# EAGLE design Rev 1 (EAGLE 5.11)
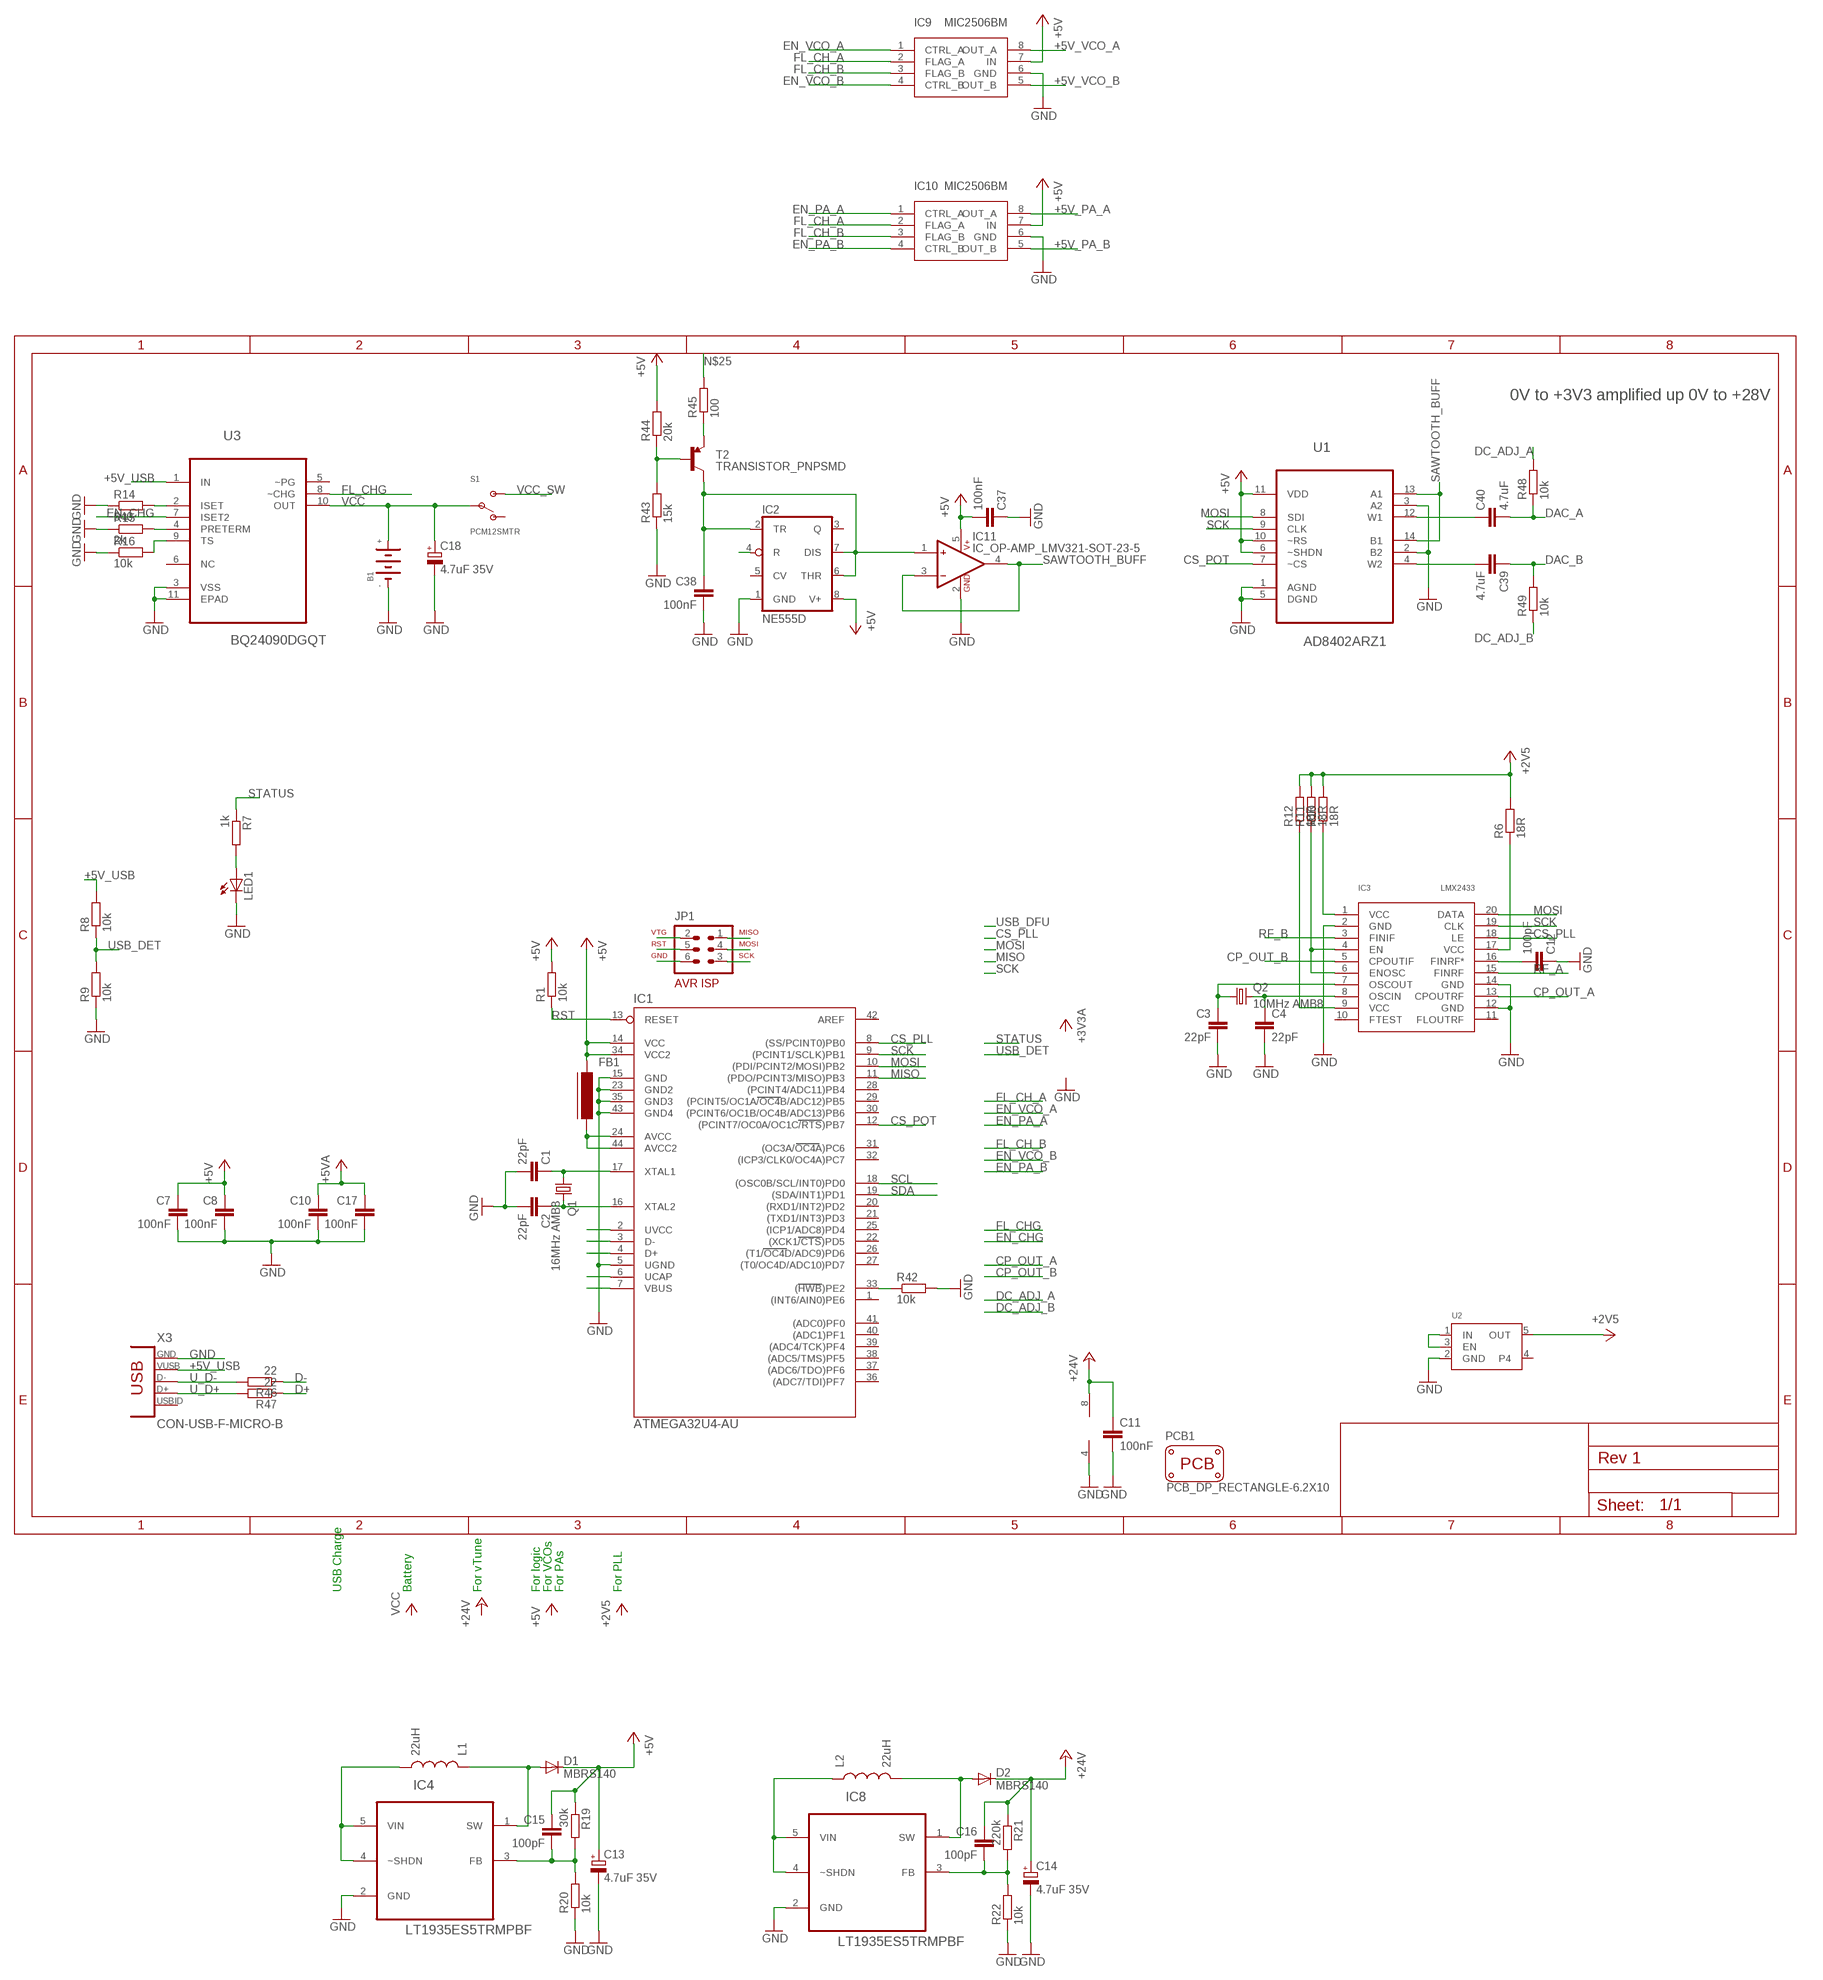
[diagram p0: schematic, sheet 1, part 1 of 2]
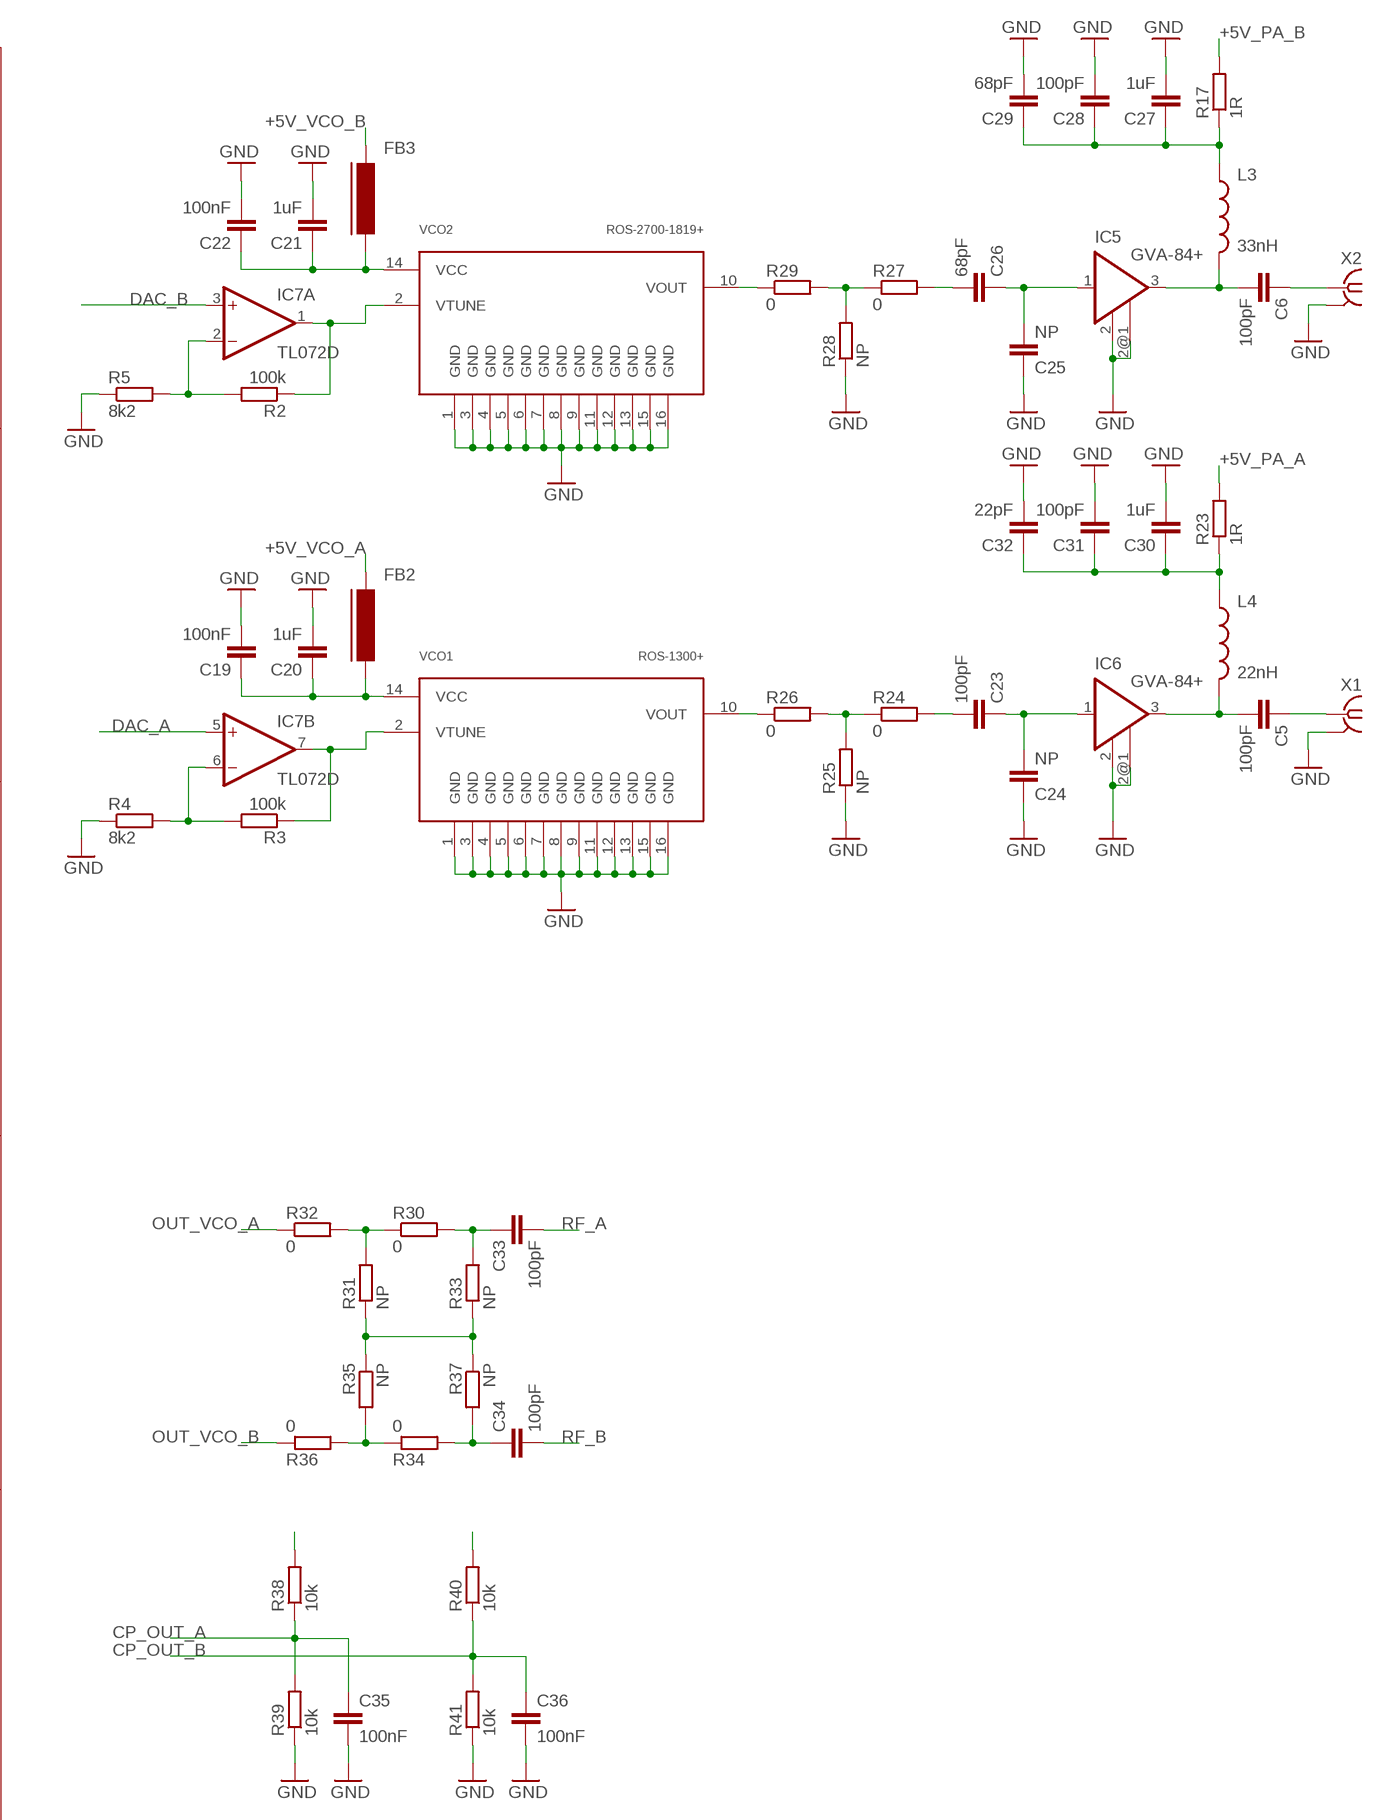
[diagram p1: schematic, sheet 1, part 2 of 2]

## Parts
B1  BATTERY  [JSTPH2]
C1  22pF  C-EUC0603K  [C0603K]
C2  22pF  C-EUC0603K  [C0603K]
C3  22pF  C-EUC0603K  [C0603K]
C4  22pF  C-EUC0603K  [C0603K]
C5  100pF  C-EUC0603K  [C0603K]
C6  100pF  C-EUC0603K  [C0603K]
C7  100nF  C-EUC0603K  [C0603K]
C8  100nF  C-EUC0603K  [C0603K]
C10  100nF  C-EUC0603K  [C0603K]
C11  100nF  C-EUC0603K  [C0603K]
C12  100pF  C-EUC0603K  [C0603K]
C13  4.7uF 35V  CPOL-EUC/6032-28R  [C/6032-28R]
C14  4.7uF 35V  CPOL-EUC/6032-28R  [C/6032-28R]
C15  100pF  C-EUC0603K  [C0603K]
C16  100pF  C-EUC0603K  [C0603K]
C17  100nF  C-EUC0603K  [C0603K]
C18  4.7uF 35V  CPOL-EUC/6032-28R  [C/6032-28R]
C19  100nF  C-EUC0603K  [C0603K]
C20  1uF  C-EUC0603K  [C0603K]
C21  1uF  C-EUC0603K  [C0603K]
C22  100nF  C-EUC0603K  [C0603K]
C23  100pF  C-EUC0603K  [C0603K]
C24  NP  C-EUC0603K  [C0603K]
C25  NP  C-EUC0603K  [C0603K]
C26  68pF  C-EUC0603K  [C0603K]
C27  1uF  C-EUC0603K  [C0603K]
C28  100pF  C-EUC0603K  [C0603K]
C29  68pF  C-EUC0603K  [C0603K]
C30  1uF  C-EUC0603K  [C0603K]
C31  100pF  C-EUC0603K  [C0603K]
C32  22pF  C-EUC0603K  [C0603K]
C33  100pF  C-EUC0603K  [C0603K]
C34  100pF  C-EUC0603K  [C0603K]
C35  100nF  C-EUC0603K  [C0603K]
C36  100nF  C-EUC0603K  [C0603K]
C37  100nF  C-EUC0603K  [C0603K]
C38  100nF  C-EUC0603K  [C0603K]
C39  4.7uF  C-EUC0603K  [C0603K]
C40  4.7uF  C-EUC0603K  [C0603K]
D1  MBRS140  DIODE-DO214AA  [DO214AA]
D2  MBRS140  DIODE-DO214AA  [DO214AA]
FB1  FERRITE-0603  [FB603]
FB2  FERRITE-0603  [FB603]
FB3  FERRITE-0603  [FB603]
IC1  ATMEGA32U4-AU  [TQFP44]
IC2  NE555D  [SO08]
IC3  LMX2433  LMX243LMX2433  [TSSOP20]
IC4  LT1935ES5TRMPBF  [SOT95P280X100-5N]
IC5  GVA-84+  [SOT89]
IC6  GVA-84+  [SOT89]
IC7  TL072D  [SO08]
IC8  LT1935ES5TRMPBF  [SOT95P280X100-5N]
IC9  MIC2506BM  [SOIC8]
IC10  MIC2506BM  [SOIC8]
IC11  IC_OP-AMP_LMV321-SOT-23-5  [SOT-23-5]
JP1  AVR-ISP-6  [AVR-ISP-6]
L1  22uH  INDUCTORNPI75  [NPI75C]
L2  22uH  INDUCTORNPI75  [NPI75C]
L3  33nH  INDUCTOR0603  [0603]
L4  22nH  INDUCTOR0603  [0603]
LED1  LEDMICRO-SIDELED  [MICRO-SIDELED]
PCB1  PCB_DP_RECTANGLE-6.2X10  [DP10062_V1]
Q1  16MHz AMB8  AMB8  [AMB8]
Q2  10MHz AMB8  AMB8  [AMB8]
R1  10k  R-EU_R0603  [R0603]
R2  100k  R-EU_R0603  [R0603]
R3  100k  R-EU_R0603  [R0603]
R4  8k2  R-EU_R0603  [R0603]
R5  8k2  R-EU_R0603  [R0603]
R6  18R  R-EU_R0603  [R0603]
R7  1k  R-EU_R0603  [R0603]
R8  10k  R-EU_R0603  [R0603]
R9  10k  R-EU_R0603  [R0603]
R10  18R  R-EU_R0603  [R0603]
R11  18R  R-EU_R0603  [R0603]
R12  18R  R-EU_R0603  [R0603]
R14  540  R-EU_R0603  [R0603]
R15  2k  R-EU_R0603  [R0603]
R16  10k  R-EU_R0603  [R0603]
R17  1R  R-EU_R0603  [R0603]
R19  30k  R-EU_R0603  [R0603]
R20  10k  R-EU_R0603  [R0603]
R21  220k  R-EU_R0603  [R0603]
R22  10k  R-EU_R0603  [R0603]
R23  1R  R-EU_R0603  [R0603]
R24  0  R-EU_R0603  [R0603]
R25  NP  R-EU_R0603  [R0603]
R26  0  R-EU_R0603  [R0603]
R27  0  R-EU_R0603  [R0603]
R28  NP  R-EU_R0603  [R0603]
R29  0  R-EU_R0603  [R0603]
R30  0  R-EU_R0603  [R0603]
R31  NP  R-EU_R0603  [R0603]
R32  0  R-EU_R0603  [R0603]
R33  NP  R-EU_R0603  [R0603]
R34  0  R-EU_R0603  [R0603]
R35  NP  R-EU_R0603  [R0603]
R36  0  R-EU_R0603  [R0603]
R37  NP  R-EU_R0603  [R0603]
R38  10k  R-EU_R0603  [R0603]
R39  10k  R-EU_R0603  [R0603]
R40  10k  R-EU_R0603  [R0603]
R41  10k  R-EU_R0603  [R0603]
R42  10k  R-EU_R0603  [R0603]
R43  15k  R-EU_R0603  [R0603]
R44  20k  R-EU_R0603  [R0603]
R45  100  R-EU_R0603  [R0603]
R46  22  R-EU_R0603  [R0603]
R47  22  R-EU_R0603  [R0603]
R48  10k  R-EU_R0603  [R0603]
R49  10k  R-EU_R0603  [R0603]
S1  PCM12SMTR  [PCM12SMTR]
T2  TRANSISTOR_PNPSMD  [SOT23-3]
U1  AD8402ARZ1  [SOIC127P600X175-14N]
U2  VREG_SOT23-5  [SOT23-5]
U3  BQ24090DGQT  [SOP50P490X110-11N]
VCO1  ROS-1300+  VCO  [CK605]
VCO2  ROS-2700-1819+  VCO  [CK605]
X1  SMA-142-0701-871/876  [J502-ND-142-0701-871/876]
X2  SMA-142-0701-871/876  [J502-ND-142-0701-871/876]
X3  CON-USB-F-MICRO-B  [CONN_USB_MICRO-B]

## Nets
+2V5: R6.2 R10.2 R11.2 R12.2 R38.2 R40.2 U2.5(OUT)
+5_USB: IC1.2(UVCC)
+5V: C7.1 C8.1 C13.+ C15.1 C37.2 D1.C FB1.1 IC1.14(VCC) IC1.34(VCC2) IC2.4(R) IC2.8(V+) IC9.7(IN) IC10.7(IN) IC11.5(V+) JP1.2 R1.2 R19.1 R44.2 U1.6(~SHDN) U1.10(~RS) U1.11(VDD) U2.1(IN) U2.3(EN)
+5V_PA_A: IC10.8(OUT_A) R23.2
+5V_PA_B: IC10.5(OUT_B) R17.2
+5V_USB: R8.2 U3.1(IN) X3.P1(VUSB)
+5V_VCO_A: FB2.1 IC9.8(OUT_A)
+5V_VCO_B: FB3.1 IC9.5(OUT_B)
+5VA: C10.1 C17.1 FB1.2 IC1.24(AVCC) IC1.44(AVCC2)
+24V: C11.1 C14.+ C16.1 D2.C IC7.8(P:V+) R21.1
CP_OUT_A: C35.1 IC3.13(CPOUTRF) R38.1 R39.2
CP_OUT_B: C36.1 IC3.5(CPOUTIF) R40.1 R41.2
CS_PLL: IC1.8((SS/PCINT0)PB0) IC3.18(LE)
CS_POT: IC1.12((PCINT7/OC0A/OC1C/RTS)PB7) U1.7(~CS)
D+: IC1.4(D+) R47.1
D-: IC1.3(D-) R46.1
DAC_A: C40.2 IC7.5(B:+IN) R48.1
DAC_B: C39.1 IC7.3(A:+IN) R49.2
DC_ADJ_A: R48.2
DC_ADJ_B: R49.1
EN_CHG: U3.7(ISET2)
EN_PA_A: IC10.1(CTRL_A)
EN_PA_B: IC10.4(CTRL_B)
EN_VCO_A: IC9.1(CTRL_A)
EN_VCO_B: IC9.4(CTRL_B)
FB_5V: C15.2 IC4.3(FB) R19.2 R20.2
FB_24V: C16.2 IC8.3(FB) R21.2 R22.2
FL_CH_A: IC9.2(FLAG_A) IC10.2(FLAG_A)
FL_CH_B: IC9.3(FLAG_B) IC10.3(FLAG_B)
FL_CHG: U3.8(~CHG)
GND: B1.1(-) C1.2 C2.2 C3.2 C4.2 C7.2 C8.2 C10.2 C11.2 C12.1 C13.- C14.- C17.2 C18.- C19.2 C20.2 C21.2 C22.2 C24.1 C25.1 C27.2 C28.2 C29.2 C30.2 C31.2 C32.2 C35.2 C36.2 C37.1 C38.2 IC1.5(UGND) IC1.15(GND) IC1.23(GND2) IC1.35(GND3) IC1.43(GND4) IC2.1(GND) IC3.2(GND) IC3.12(GND) IC3.14(GND) IC4.2(GND) IC5.2(GND) IC5.2@1(GND) IC6.2(GND) IC6.2@1(GND) IC7.4(P:V-) IC8.2(GND) IC9.6(GND) IC10.6(GND) IC11.2(GND) JP1.6 LED1.C R4.1 R5.1 R9.1 R14.1 R15.1 R16.1 R20.1 R22.1 R25.1 R28.1 R31.1 R33.1 R35.1 R37.1 R39.1 R41.1 R42.2 R43.1 U1.1(AGND) U1.2(B2) U1.3(A2) U1.5(DGND) U2.2(GND) U3.3(VSS) U3.11(EPAD) VCO1.1(GND) VCO1.3(GND) VCO1.4(GND) VCO1.5(GND) VCO1.6(GND) VCO1.7(GND) VCO1.8(GND) VCO1.9(GND) VCO1.11(GND) VCO1.12(GND) VCO1.13(GND) VCO1.15(GND) VCO1.16(GND) VCO2.1(GND) VCO2.3(GND) VCO2.4(GND) VCO2.5(GND) VCO2.6(GND) VCO2.7(GND) VCO2.8(GND) VCO2.9(GND) VCO2.11(GND) VCO2.12(GND) VCO2.13(GND) VCO2.15(GND) VCO2.16(GND) X1.G@1(GND) X2.G@1(GND) X3.P5(GND)
HWB: IC1.33((HWB)PE2) R42.1
ISET: R14.2 U3.2(ISET)
MISO: IC1.11((PDO/PCINT3/MISO)PB3) JP1.1
MOSI: IC1.10((PDI/PCINT2/MOSI)PB2) IC3.20(DATA) JP1.4 U1.8(SDI)
N$3: C12.2 IC3.16(FINRF*)
N$4: IC7.2(A:-IN) R2.2 R5.2
N$6: IC7.6(B:-IN) R3.2 R4.2
N$11: C6.1 X2.1
N$12: C5.1 X1.1
N$13: C19.1 C20.1 FB2.2 VCO1.14(VCC)
N$14: C21.1 C22.1 FB3.2 VCO2.14(VCC)
N$17: LED1.A R7.2
N$18: IC3.1(VCC) R10.1
N$19: IC3.17(VCC) R6.1
N$20: IC3.4(EN) IC3.6(ENOSC) R11.1
N$21: IC3.9(VCC) R12.1
N$22: C30.1 C31.1 C32.1 L4.1 R23.1
N$23: R45.1 T2.2(E)
N$24: R30.1 R31.2 R32.2
N$25: R45.2
N$26: C6.2 IC5.3(OUT) L3.2
N$28: C5.2 IC6.3(OUT) L4.2
N$29: IC1.6(UCAP)
N$30: C39.2 U1.4(W2)
N$31: R24.1 R25.2 R26.2
N$32: C23.1 C24.2 IC6.1(+IN)
N$33: C23.2 R24.2
N$34: R43.2 R44.1 T2.1(B)
N$35: R27.1 R28.2 R29.2
N$36: C25.2 C26.1 IC5.1(+IN)
N$37: C26.2 R27.2
N$38: C27.1 C28.1 C29.1 L3.1 R17.1
N$39: C33.1 R30.2 R33.2
N$40: C40.1 U1.12(W1)
N$41: IC1.7(VBUS)
N$44: R34.1 R35.2 R36.2
N$45: C34.1 R34.2 R37.2
OSC1: C3.1 IC3.7(OSCOUT) Q2.P$1
OSC2: C4.1 IC3.8(OSCIN) Q2.P$3
OUT_VCO_A: R26.1 R32.1 VCO1.10(VOUT)
OUT_VCO_B: R29.1 R36.1 VCO2.10(VOUT)
PRETERM: R15.2 U3.4(PRETERM)
RF_A: C33.2 IC3.15(FINRF)
RF_B: C34.2 IC3.3(FINIF)
RST: IC1.13(RESET) JP1.5 R1.1
SAWTOOTH: C38.1 IC2.2(TR) IC2.6(THR) IC2.7(DIS) IC11.1(+) T2.3(C)
SAWTOOTH_BUFF: IC11.3(-) IC11.4(OUT) U1.13(A1) U1.14(B1)
SCK: IC1.9((PCINT1/SCLK)PB1) IC3.19(CLK) JP1.3 U1.9(CLK)
SCL: IC1.18((OSC0B/SCL/INT0)PD0)
SDA: IC1.19((SDA/INT1)PD1)
STATUS: R7.1
SW_5V: D1.A IC4.1(SW) L1.1
SW_24V: D2.A IC8.1(SW) L2.2
TS: R16.2 U3.9(TS)
U_D+: R47.2 X3.P3(D+)
U_D-: R46.2 X3.P2(D-)
USB_DET: R8.1 R9.2
VCC: B1.2(+) C18.+ S1.2 U3.10(OUT)
VCC_SW: IC4.4(~SHDN) IC4.5(VIN) IC8.4(~SHDN) IC8.5(VIN) L1.2 L2.1 S1.1
VTUNE_A: IC7.7(B:OUT) R3.1 VCO1.2(VTUNE)
VTUNE_B: IC7.1(A:OUT) R2.1 VCO2.2(VTUNE)
XTAL1: C1.1 IC1.17(XTAL1) Q1.P$1
XTAL2: C2.1 IC1.16(XTAL2) Q1.P$3
Unconnected: IC1.1((INT6/AIN0)PE6) IC1.20((RXD1/INT2)PD2) IC1.21((TXD1/INT3)PD3) IC1.22((XCK1/CTS)PD5) IC1.25((ICP1/ADC8)PD4) IC1.26((T1/OC4D/ADC9)PD6) IC1.27((T0/OC4D/ADC10)PD7) IC1.28((PCINT4/ADC11)PB4) IC1.29((PCINT5/OC1A/OC4B/ADC12)PB5) IC1.30((PCINT6/OC1B/OC4B/ADC13)PB6) IC1.31((OC3A/OC4A)PC6) IC1.32((ICP3/CLK0/OC4A)PC7) IC1.36((ADC7/TDI)PF7) IC1.37((ADC6/TDO)PF6) IC1.38((ADC5/TMS)PF5) IC1.39((ADC4/TCK)PF4) IC1.40((ADC1)PF1) IC1.41((ADC0)PF0) IC1.42(AREF) IC2.3(Q) IC2.5(CV) IC3.10(FTEST) IC3.11(FLOUTRF) S1.3 U2.4 U3.5(~PG) U3.6(NC) X3.BODY@1(BODY) X3.BODY@2(BODY) X3.BODY@3(BODY) X3.BODY@4(BODY) X3.P4(USBID)

## Notes on the sheet
- 0V to +3V3 amplified up 0V to +28V
- USB Charge | Battery | For vTune | For logic | For VCOs | For PAs | For PLL

## Power pins joined to a net without a drawn wire
GND: X1.G@2(GND) X1.G@3(GND) X1.G@4(GND) X2.G@2(GND) X2.G@3(GND) X2.G@4(GND)

## Library data of the parts
B1 = microbuilder:BATTERY
C1-C8 C10-C12 C15-C17 C19-C40 = rcl:C-EU: CAPACITOR, European symbol
C13 C14 C18 = rcl:CPOL-EU: POLARIZED CAPACITOR, European symbol
D1 D2 = diode:DIODE-: DIODE
FB1-FB3 = dp_devices:FERRITE: Ferrite bead in various packages
IC1 = mega32U4:ATMEGA32U4-AU
IC2 = linear:*555: TIMER
IC3 = general:LMX243*
IC4 IC8 = general:LT1935ES5TRMPBF: 1.2MHz Boost DC/DC Converter; MPN: LT1935ES5#TRMPBF; OC_FARNELL: 1663812; OC_NEWARK: 59M8317; PACKAGE: TSOT-23-5; SUPPLIER: Linear Technology
IC5 IC6 = linear:GVA-84+: Monolithic Amplifier DC-6 GHz Source: GVA-84+.pdf
IC7 = linear:TL072: OP AMP
IC9 IC10 = general:MIC2506BM
IC11 = dp_devices:IC_OP-AMP_LMV321: Low voltage op-amp (2.7 - 5.0V)
JP1 = avr-6:AVR-ISP-6: AVR ISP-6 Serial Programming Header
L1-L4 = SparkFun march 2012:INDUCTOR: Inductors Basic Inductor/Choke - 0603 and 1206. Footprints are not proven and vary greatly between part numbers.
LED1 = led:LED: LED OSRAM: - CHIPLED LG R971, LG N971, LY N971, LG Q971, LY Q971, LO R971, LY R971 LH N974, LH R974 LS Q976, LO Q976, LY Q976 LO Q996 - Hyper CHIPLED LW Q18S LB Q993, LB Q99A, LB R99A - SideLED LS A670, LO A670, LY A670, LG A670, LP A670 LB A673, LV A673, LT A673, LW A673 LH A674 LY A675 LS A676, LA A676, LO A676, LY A676, LW A676 LS A679, LY A679, LG A679 - Hyper Micro SIDELED® LS Y876, LA Y876, LO Y876, LY Y876 LT Y87S - SmartLED LW L88C, LW L88S LB L89C, LB L89S, LG L890 LS L89K, LO L89K, LY L89K LS L896, LA L896, LO L896, LY L896 - TOPLED LS T670, LO T670, LY T670, LG T670, LP T670 LSG T670, LSP T670, LSY T670, LOP T670, LYG T670 LG T671, LOG T671, LSG T671 LB T673, LV T673, LT T673, LW T673 LH T674 LS T676, LA T676, LO T676, LY T676, LB T676, LH T676, LSB T676, LW T676 LB T67C, LV T67C, LT T67C, LS T67K, LO T67K, LY T67K, LW E67C LS E67B, LA E67B, LO E67B, LY E67B, LB E67C, LV E67C, LT E67C LW T67C LS T679, LY T679, LG T679 LS T770, LO T770, LY T770, LG T770, LP T770 LB T773, LV T773, LT T773, LW T773 LH T774 LS E675, LA E675, LY E675, LS T675 LS T776, LA T776, LO T776, LY T776, LB T776 LHGB T686 LT T68C, LB T68C - Hyper Mini TOPLED® LB M676 - Mini TOPLED Santana® LG M470 LS M47K, LO M47K, LY M47K Source: http://www.osram.convergy.de LUXEON: - LUMILED® LXK2-PW12-R00, LXK2-PW12-S00, LXK2-PW14-U00, LXK2-PW14-V00 LXK2-PM12-R00, LXK2-PM12-S00, LXK2-PM14-U00 LXK2-PE12-Q00, LXK2-PE12-R00, LXK2-PE12-S00, LXK2-PE14-T00, LXK2-PE14-U00 LXK2-PB12-K00, LXK2-PB12-L00, LXK2-PB12-M00, LXK2-PB14-N00, LXK2-PB14-P00, LXK2-PB14-Q00 LXK2-PR12-L00, LXK2-PR12-M00, LXK2-PR14-Q00, LXK2-PR14-R00 LXK2-PD12-Q00, LXK2-PD12-R00, LXK2-PD12-S00 LXK2-PH12-R00, LXK2-PH12-S00 LXK2-PL12-P00, LXK2-PL12-Q00, LXK2-PL12-R00 Source: www.luxeon.com KINGBRIGHT: KA-3528ASYC Source: www.kingbright.com
PCB1 = dp_devices:PCB_DP_RECTANGLE: Dangerous Prototypes Standard Rectangular PCB sizes
Q1 Q2 = crystal:AMB8
R1-R12 R14-R17 R19-R49 = rcl:R-EU_: RESISTOR, European symbol
S1 = general:PCM12SMTR
T2 = SparkFun march 2012:TRANSISTOR_PNP
U1 = general:AD8402ARZ1: 1-/2-/4-Channel Digital Potentiometers; MPN: AD8402ARZ1; OC_FARNELL: 1340532; OC_NEWARK: 88H0234; PACKAGE: SOIC-14; SUPPLIER: Analog Devices
U2 = microbuilder:VREG_SOT23-5: SOT23-5 Fixed Voltage Regulators To better organise some of the SOT23-5 fixed voltage regulators in this library, this new part was created. Part Current Out V Out V In V Dropout Digikey Part No. ADP121 150mA 3.3V 3.4-5.5V 0.09V @ 150mA ADP121-AUJZ33R7CT-ND ADP121 150mA 3.0V 3.1-5.5V 0.09V @ 150mA ADP121-AUJZ30R7CT-ND ADP122 300mA 3.3V 3.4-5.5V 0.085V @ 300mA ADP122AUJZ-3.3-R7CT-ND ADP1712 300mA 3.3V 3.5-5.5V 0.17V @ 300mA ADP1712AUJZ-3.3-R7TR-ND AP7311 (Low Cost) 150mA 3.3V 3.5-6V 0.15V @ 150mA AP7311-33WG-7DICT-ND LD39015M18R 150mA 1.8V 1.9V-5.5V 0.08V @ 100mA 497-6977-1-ND MCP1824T-3302E/OT 300mA 3.3V 3.5V-6V 0.2V @ 300mA MCP1824T-3302E/OTCT-ND MIC5205-2.5YM5 TR 150mA 2.5V 2.7-16V 0.165V @ 150mA 576-1257-2-ND MIC5205-3.0YM5 TR 150mA 3.0V 3.2V-16V 0.165V @ 150mA 576-1258-2-ND MIC5205-3.3YM5 TR 150mA 3.3V 3.5V-16V 0.165V @ 150mA 576-1259-2-ND TPS780330220 150mA 3.3V+2.2V 3.6-5.5V 250mV Max 296-23332-1-ND TDA3663/N1,135 100mA 3.3V 3.5-45V 0.18V @ 50mA 568-5343-1-ND
U3 = general:BQ24090DGQT: 1A, Single-Input, Single Cell Li-Ion Battery Charger; MPN: BQ24090DGQT; OC_FARNELL: 1815715; OC_NEWARK: 67R4097; PACKAGE: MSOP-10; SUPPLIER: Texas Instruments
VCO1 VCO2 = general:VCO
X1 X2 = con-coax:SMA-: SMA 50 Ohm End Launch Jack Receptacle - Round Contact Johnson Components Source: www.johnsoncomponents.com .. J502-ND.pdf
X3 = dp_devices:CON-USB-F: USB Female connector

## Board
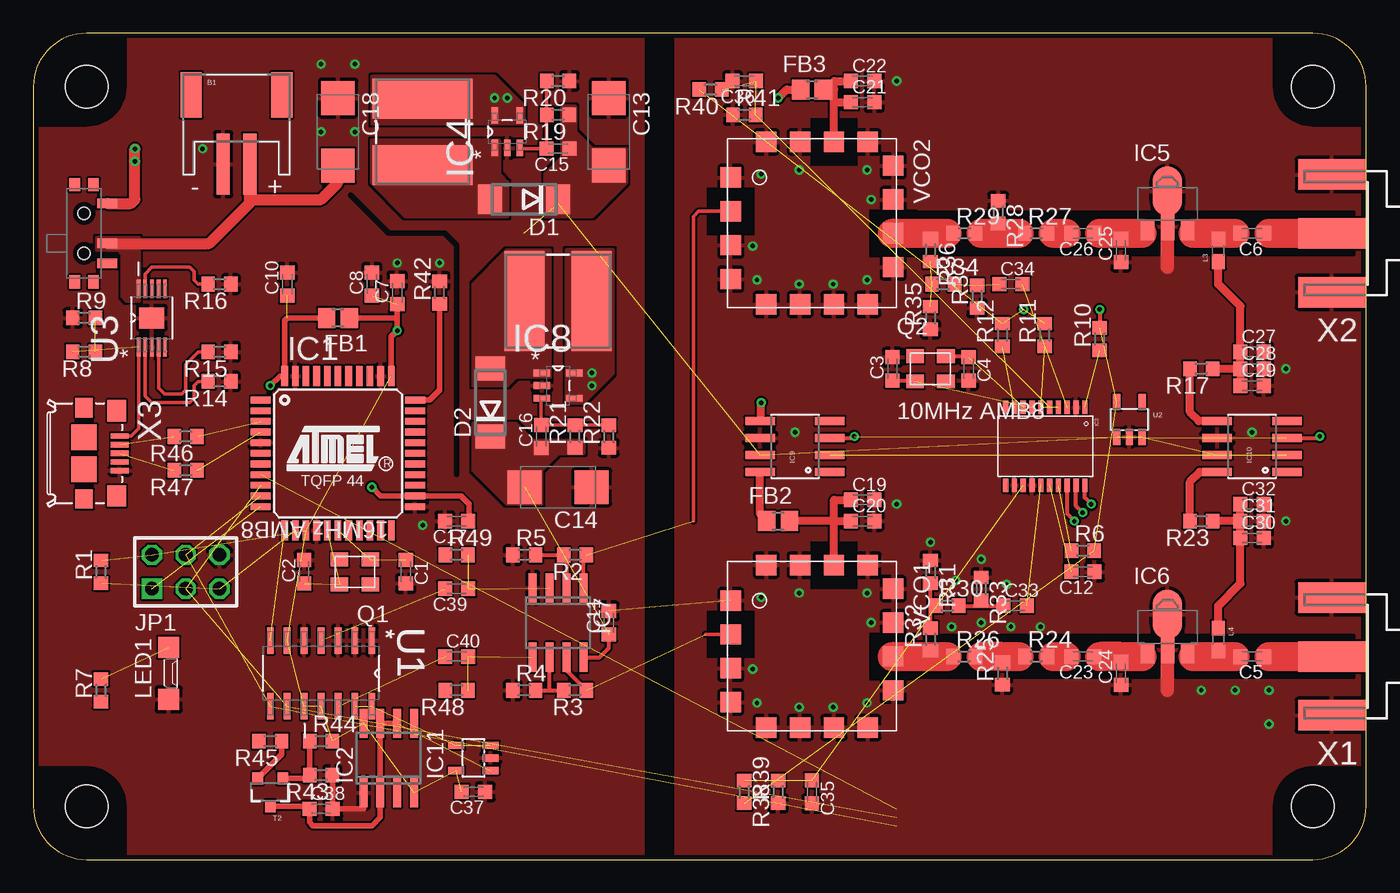
[diagram p2: board, top side]
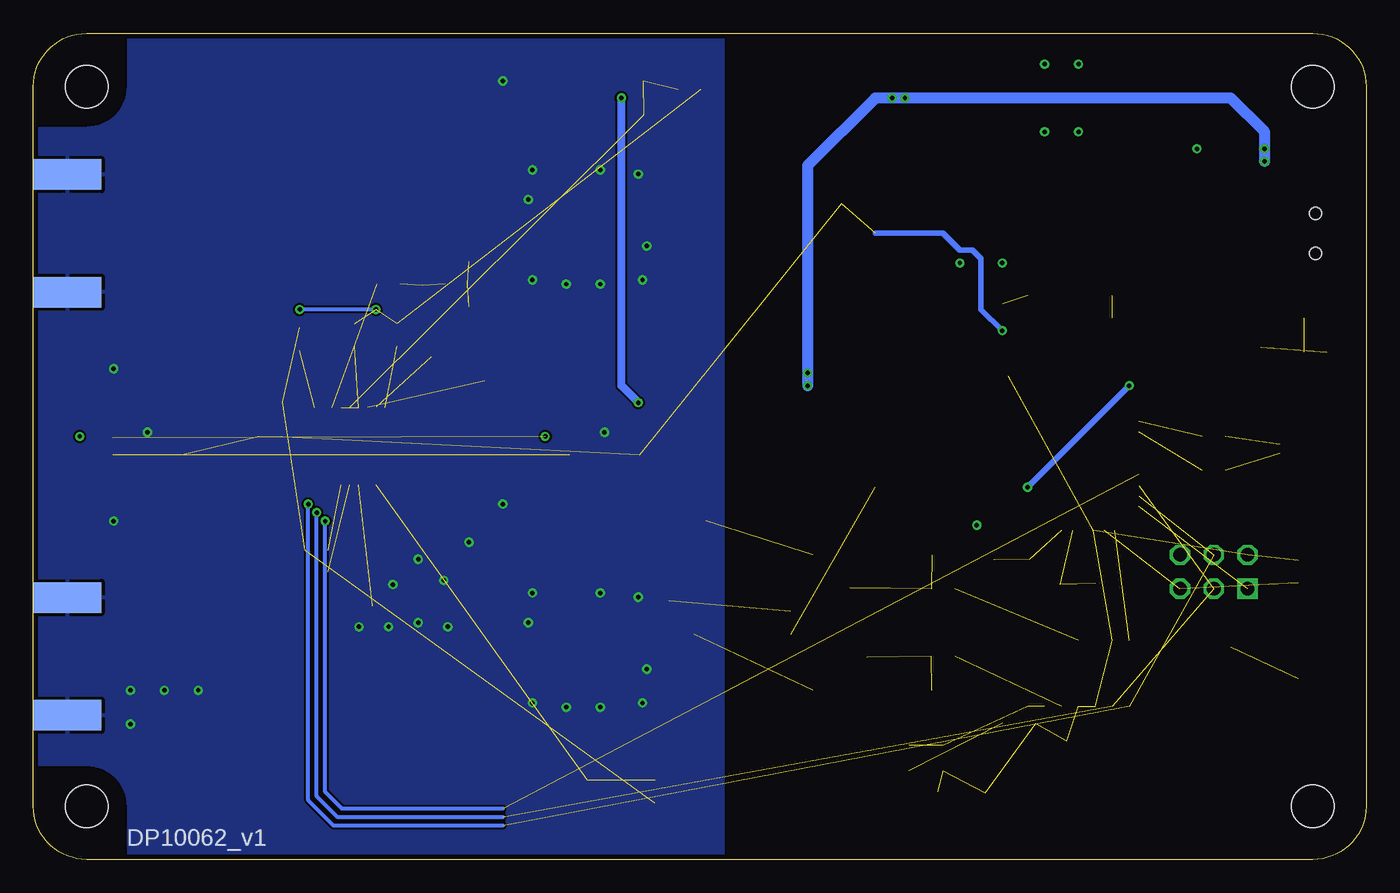
[diagram p3: board, bottom side, seen from below]

Size 100 x 62 mm. Coordinates in mm from the lower left corner, seen from the top.
Copper layers (1*16): Top 0.0356mm / dielectric 1.5011mm / Bottom 0.0356mm
Design rules "LaenPCBOrder": minimum track width 6mil, minimum drill 13mil, track to track 6mil, track to pad 6mil, pad to pad 6mil, via to via 6mil, smd to smd 6mil, copper to edge 15mil, drill to drill 6mil, minimum pad ring 7mil, minimum via ring 7mil, stop-mask expansion 4mil, vias tented up to drill 0mil, thermal gap 10mil
tRestrict: 22 lines

### Footprints (pad centres in the part's own frame; a part is rotated, then mirrored left to right if it is on the bottom)
JSTPH2 = smd 1 x 4.6: 1 -1,-3.7; 2 1,-3.7 | smd 1.6 x 3.4: NC1 -3.4,1.5; NC2 3.4,1.5
C0603K = smd 1.05 x 1.08: 1 -0.875,0; 2 0.875,0
C/6032-28R = smd 2.55 x 2.5: + 2.525,0; - -2.525,0
DO214AA = smd 1.8 x 2.2: A 2.55,0; C -2.55,0
FB603 = smd 1.3 x 1.5: 1 -0.85,0; 2 0.85,0
TQFP44 = smd 1.5 x 0.5: 1 -5.8,4; 2 -5.8,3.2; 3 -5.8,2.4; 4 -5.8,1.6; 5 -5.8,0.8; 6 -5.8,0; 7 -5.8,-0.8; 8 -5.8,-1.6; 9 -5.8,-2.4; 10 -5.8,-3.2; 11 -5.8,-4; 23 5.8,-4; 24 5.8,-3.2; 25 5.8,-2.4; 26 5.8,-1.6; 27 5.8,-0.8; 28 5.8,0; 29 5.8,0.8; 30 5.8,1.6; 31 5.8,2.4; 32 5.8,3.2; 33 5.8,4 | smd 0.5 x 1.5: 12 -4,-5.8; 13 -3.2,-5.8; 14 -2.4,-5.8; 15 -1.6,-5.8; 16 -0.8,-5.8; 17 0,-5.8; 18 0.8,-5.8; 19 1.6,-5.8; 20 2.4,-5.8; 21 3.2,-5.8; 22 4,-5.8; 34 4,5.8; 35 3.2,5.8; 36 2.4,5.8; 37 1.6,5.8; 38 0.8,5.8; 39 0,5.8; 40 -0.8,5.8; 41 -1.6,5.8; 42 -2.4,5.8; 43 -3.2,5.8; 44 -4,5.8
SO08 = smd 0.6 x 2.2: 1 -1.905,-2.6; 2 -0.635,-2.6; 3 0.635,-2.6; 4 1.905,-2.6; 5 1.905,2.6; 6 0.635,2.6; 7 -0.635,2.6; 8 -1.905,2.6
TSSOP20 = smd 1 x 0.4: 1 -2.937,2.693; 2 -2.937,2.032; 3 -2.937,1.372; 4 -2.937,0.712; 5 -2.937,0.051; 6 -2.937,-0.609; 7 -2.937,-1.27; 8 -2.943,-1.93; 9 -2.937,-2.59; 10 -2.937,-3.251; 11 2.905,-3.251; 12 2.905,-2.59; 13 2.911,-1.93; 14 2.905,-1.27; 15 2.905,-0.609; 16 2.905,0.051; 17 2.905,0.712; 18 2.905,1.372; 19 2.905,2.032; 20 2.905,2.693
SOT95P280X100-5N = smd 1.219 x 0.508: 1 -1.219,0.94; 2 -1.219,0; 3 -1.219,-0.94; 4 1.219,-0.94; 5 1.219,0.94
SOT89 = smd 1 x 1.5: 1 -1.499,-1.981; 3 1.499,-1.981 | smd 1 x 2: 2 0,-1.727 | smd 2.2 x 3.7: 2@1 0,0.94
SOIC8 = smd 0.61 x 2.21: 1 -1.905,-2.616; 2 -0.635,-2.616; 3 0.635,-2.616; 4 1.905,-2.616; 5 1.905,2.616; 6 0.635,2.616; 7 -0.635,2.616; 8 -1.905,2.616
SOT-23-5 = smd 0.55 x 1.2: 1 -0.95,-1.3; 2 0,-1.3; 3 0.95,-1.3; 4 0.95,1.3; 5 -0.95,1.3
AVR-ISP-6 = drill 1.016 square: 1 -2.54,-1.27 | drill 1.016 octagon: 2 -2.54,1.27; 3 0,-1.27; 4 0,1.27; 5 2.54,-1.27; 6 2.54,1.27
NPI75C = smd 3 x 7.5: 1 -2.5,0; 2 2.5,0
0603 = smd 1.1 x 1: 1 -0.85,0; 2 0.85,0
MICRO-SIDELED = smd 1.6 x 1.6: A 0,1.95; C 0,-1.95
DP10062_V1 = hole 3.2: 4,4; 96,4; 96,58; 4,58
AMB8 = smd 1.321 x 1.041: P$1 -1.156,-0.94; P$2 1.156,-0.94; P$3 1.156,0.94; P$4 -1.156,0.94
R0603 = smd 1 x 1.1: 1 -0.85,0; 2 0.85,0
PCM12SMTR = smd 0.711 x 1.499: 1 -2.235,1.74; 2 0.762,1.74; 3 2.261,1.74 | smd 0.991 x 0.813: GND@1 -3.645,0.699; GND@2 -3.645,-0.699; GND@3 3.645,0.699; GND@4 3.645,-0.699 | hole 0.9: -1.499,0; 1.499,0
SOT23-3 = smd 0.8 x 0.9: 1 -0.95,-1; 2 0.95,-1; 3 0,1.1
SOIC127P600X175-14N = smd 1.981 x 0.508: 1 -2.464,3.81; 2 -2.464,2.54; 3 -2.464,1.27; 4 -2.464,0; 5 -2.464,-1.27; 6 -2.464,-2.54; 7 -2.464,-3.81; 8 2.464,-3.81; 9 2.464,-2.54; 10 2.464,-1.27; 11 2.464,0; 12 2.464,1.27; 13 2.464,2.54; 14 2.464,3.81
SOT23-5 = smd 0.55 x 1.2: 1 -0.95,-1.3; 2 0,-1.3; 3 0.95,-1.3; 4 0.95,1.3; 5 -0.95,1.3
SOP50P490X110-11N = smd 1.422 x 0.279: 1 -2.184,0.991; 2 -2.184,0.508; 3 -2.184,0; 4 -2.184,-0.508; 5 -2.184,-0.991; 6 2.184,-0.991; 7 2.184,-0.508; 8 2.184,0; 9 2.184,0.508; 10 2.184,0.991 | smd 1.575 x 1.88: 11 0,0
CK605 = smd 1.524 x 1.524: 1 -3.429,-6.096; 2 -0.889,-6.096; 3 1.651,-6.096; 4 4.191,-6.096; 5 6.096,-3.429; 6 6.096,-0.889; 7 6.096,1.651; 8 6.096,4.191; 9 3.302,6.096; 10 0.762,6.096; 11 -1.778,6.096; 12 -4.318,6.096; 13 -6.096,4.191; 14 -6.096,1.651; 15 -6.096,-0.889; 16 -6.096,-3.429
J502-ND-142-0701-871/876 = smd 5.08 x 2.286: 1 2.565,0; G@1 2.565,4.42; G@2 2.565,-4.42 | smd 5.08 x 2.286 bottom: G@3 2.565,4.42; G@4 2.565,-4.42
CONN_USB_MICRO-B = smd 1.6 x 1.4: BODY@1 -3.2,2.45; BODY@2 3.2,2.45 | smd 1.45 x 1.3: BODY@3 3.425,0; BODY@6 -3.425,0 | smd 1.9 x 1.9: BODY@4 1.2,0; BODY@5 -1.2,0 | smd 0.4 x 1.35: P1 -1.3,2.675; P2 -0.65,2.675; P3 0,2.675; P4 0.65,2.675; P5 1.3,2.675

### Placement (x,y rotation side)
B1  15.24,55.88 0 top
C1  27.94,21.59 270 top
C2  20.32,21.59 90 top
C3  64.45,36.83 90 top
C4  70.17,36.83 270 top
C5  91.44,15.24 180 top
C6  91.44,46.99 180 top
C7  27.3,42.55 90 top
C8  25.4,43.18 90 top
C10  19.05,43.18 90 top
C11  43.18,17.78 90 top
C12  78.74,21.59 180 top
C13  43.18,54.61 270 top
C14  39.37,27.94 180 top
C15  39.37,53.34 180 top
C16  38.1,31.75 90 top
C17  31.75,25.4 180 top
C18  22.86,54.61 270 top
C19  62.23,26.99 0 top
C20  62.23,25.4 0 top
C21  62.23,56.83 0 top
C22  62.23,58.42 0 top
C23  78.74,15.24 180 top
C24  81.6,13.97 90 top
C25  81.6,45.72 90 top
C26  78.74,46.99 180 top
C27  91.44,38.1 0 top
C28  91.44,36.83 0 top
C29  91.44,35.56 0 top
C30  91.44,24.13 0 top
C31  91.44,25.4 0 top
C32  91.44,26.67 0 top
C33  73.66,19.05 0 top
C34  73.34,43.18 0 top
C35  58.42,5.08 270 top
C36  53.34,58.42 180 top
C37  33.02,5.08 180 top
C38  21.59,3.81 0 top
C39  31.75,20.32 180 top
C40  31.75,15.24 0 top
D1  36.83,49.53 180 top
D2  34.29,34.29 90 top
FB1  22.86,40.64 180 top
FB2  55.88,25.4 0 top
FB3  58.42,57.78 0 top
IC1  22.86,30.48 0 top
IC2  26.67,7.62 0 top
IC3  76.2,31 270 top
IC4  35.56,54.61 90 top
IC5  85.09,49.21 0 top
IC6  85.09,17.46 0 top
IC7  39.37,17.78 180 top
IC8  39.37,35.56 0 top
IC9  57.15,31 90 top
IC10  91.44,31 90 top
IC11  33.02,7.62 90 top
JP1  11.43,21.59 0 top
L1  29.21,54.61 90 top
L2  39.37,41.91 180 top
L3  88.9,45.72 90 top
L4  88.9,16.51 270 top
LED1  10.16,13.97 0 top
PCB1  0,0 0 top
Q1  24.13,21.59 180 top
Q2  67.31,36.83 0 top
R1  5.08,21.59 90 top
R2  40.64,22.86 180 top
R3  40.64,12.7 180 top
R4  36.83,12.7 0 top
R5  36.83,22.86 0 top
R6  78.74,23.18 0 top
R7  5.08,12.7 90 top
R8  3.81,38.1 180 top
R9  3.81,40.64 0 top
R10  80.01,39.05 90 top
R11  75.88,39.37 90 top
R12  72.71,39.37 90 top
R14  13.97,35.88 180 top
R15  13.97,38.1 180 top
R16  13.97,43.18 180 top
R17  87.63,36.83 180 top
R19  39.37,55.88 180 top
R20  39.37,58.42 180 top
R21  40.64,31.75 90 top
R22  43.18,31.75 90 top
R23  87.63,25.4 180 top
R24  75.25,15.24 0 top
R25  72.71,13.97 90 top
R26  69.85,15.24 0 top
R27  75.25,46.99 0 top
R28  72.39,48.58 270 top
R29  69.85,46.99 0 top
R30  68.58,19.05 0 top
R31  67.31,21.59 270 top
R32  67.31,16.51 90 top
R33  71.12,20.32 270 top
R34  68.26,43.18 0 top
R35  67.31,40.64 90 top
R36  67.31,45.72 270 top
R37  70.8,42.23 90 top
R38  53.34,5.08 270 top
R39  55.88,5.08 90 top
R40  50.8,57.78 180 top
R41  53.34,55.88 0 top
R42  30.48,42.55 90 top
R43  21.59,6.35 180 top
R44  21.59,8.89 0 top
R45  17.78,8.89 180 top
R46  11.43,31.75 180 top
R47  11.43,29.21 180 top
R48  31.75,12.7 180 top
R49  31.75,22.86 0 top
S1  3.81,46.99 270 top
T2  17.78,5.08 180 top
U1  21.59,13.97 270 top
U2  82.23,33.02 0 top
U3  8.89,40.64 90 top
VCO1  58.42,16 270 top
VCO2  58.42,47.75 270 top
X1  100,15.24 180 top
X2  100,46.99 180 top
X3  3.81,30.48 270 top

### Tracks (layer width: path | path; a pad name or v marks a point on that pad's centre or on a via)
+2V5  (via drill 0.33)  (6 unrouted)
  Top 0.305: v80.01,41.27 R10.2
  Bottom 0.305: v74.3,41.27 v80.01,41.27
+5V  (via drill 0.33)  (17 unrouted)
  Top 0.406: D1.C 39.38,49.22 | IC1.34 26.86,39.24 v27.3,39.69 27.3,40.64 | 27.3,40.64 C7.1 | 27.3,40.64 FB1.1
  Bottom 0.406: 36.83,46.99 31.75,46.99 30.48,45.72 29.53,45.72 28.89,45.09 28.89,41.27 v27.3,39.69
  pour Top (no thermals): 38.42,48.26 38.42,51.44 39.69,52.7 39.69,56.52 40.64,56.52 40.64,54.61 41.91,53.34 44.45,53.34 44.45,50.8 41.91,48.26
+5V_PA_A
  Top 0.61: IC10.8 87.52,29.09 86.78,28.36 R23.2
+5V_PA_B
  Top 0.61: IC10.5 87.43,32.91 86.78,33.55 R17.2
+5V_USB  (1 unrouted)
  Top 0.254: U3.1 7.9,32.35 7.33,31.78 X3.P1
+5V_VCO_A
  Top 0.61: IC9.8 54.53,25.9 FB2.1
+5V_VCO_B  (via drill 0.33)
  Top 0.61: IC9.5 54.61,32.98 v54.61,34.29 | FB3.1 56.52,57.78 v55.88,57.15
  Bottom 0.61: v54.61,34.29 55.88,35.56 v55.88,57.15
+5VA  (via drill 0.33)  (1 unrouted)
  Top 0.406: FB1.2 19.05,40.64 18.86,40.45 IC1.44 18.5,36.28 v17.78,35.56 | v25.4,27.94 26.06,27.28 IC1.24 32.09,27.28 32.7,26.67 32.7,25.48 C17.1
  Bottom 0.406: v25.4,27.94 v17.78,35.56
+24V  (1 unrouted)
  Top 0.305: IC7.8 42.48,15.18 43.18,15.88 C11.1
  pour Top (no thermals): 33.02,32.7 36.2,32.7 37.47,31.43 41.27,31.43 41.27,30.48 39.37,30.48 38.1,29.21 38.1,26.67 35.56,26.67 33.02,29.21
CP_OUT_A  (3 unrouted)
CP_OUT_B  (3 unrouted)
CS_PLL  (via drill 0.33)  (1 unrouted)
  Top 0.305: IC3.18 77.57,25.93 v78.11,25.4
  Bottom 0.305: v78.11,25.4 78.11,5.08 76.83,3.81 64.77,3.81
CS_POT  (1 unrouted)
D+  (1 unrouted)
D-  (1 unrouted)
DAC_A  (2 unrouted)
DAC_B  (2 unrouted)
FB_5V
  Top 0.254: 36.5,53.34 C15.2 38.49,55.88 | R19.2 R20.2
  Top 0.305: IC4.3 36.5,53.34 | 38.49,55.88 R19.2
FB_24V
  Top 0.254: IC8.3 38.1,34.62 C16.2 40.64,32.62 R21.2 R22.2
FL_CH_A  (1 unrouted)
FL_CH_B  (via drill 0.33)  (1 unrouted)
  Top 0.305: IC9.3 61.48,31.64 v61.59,31.75 | IC10.3 96.41,31.64 v96.52,31.75
GND  (via drill 0.33)  (1 unrouted)
  Top 0.406: IC2.1 24.77,3.81 C38.2 22.46,6.35 R43.1
  Top 1.016: 85.09,44.45 85.09,50.8 | 85.09,12.7 85.09,19.05
  other vias: 87.63,12.7 90.17,12.7 92.71,12.7 92.71,10.16 53.98,14.29 54.61,19.68 54.29,11.75 57.47,11.43 60.01,11.43 62.55,11.75 62.87,17.78 62.55,20 57.47,20 53.98,46.04 54.61,51.44 54.29,43.5 57.47,43.18 60.01,43.18 62.55,43.5 62.87,49.53 62.55,51.75 57.47,51.75 68.9,17.46 71.12,17.78 73.34,17.46 71.12,22.54 67.31,23.81 69.22,20.95 73.03,20.64 75.56,17.46 93.98,36.83 93.98,25.4 64.77,58.42 64.77,26.67 21.59,59.69 24.13,59.69 21.59,54.61 24.13,54.61 12.7,53.34 91.44,32.07 57.15,32.07 27.3,44.77 30.48,44.77 29.21,25.08
  pour Top (rank 6): 48.26,62 100,62 100,0 48.26,0
  pour Bottom (rank 6): 100,62 100,0 48.26,0 48.26,62
  pour Top (rank 6): 45.72,62 45.72,0 0,0 0,62
HWB
  Top 0.406: IC1.33 29.72,34.48 30.48,35.24 R42.1
ISET
  Top 0.254: U3.2 8.38,34.8 8.89,34.29 11.75,34.29 12.06,34.61 12.06,35.56 12.38,35.88 R14.2
MISO  (1 unrouted)
MOSI  (via drill 0.33)  (3 unrouted)
  Top 0.305: IC3.20 78.89,27.15 v79.38,26.67
  Bottom 0.305: v79.38,26.67 79.38,4.45 77.47,2.54 64.77,2.54
N$3  (1 unrouted)
N$4
  Top 0.305: IC7.2 40.01,22.86 R2.2 R5.2
N$6
  Top 0.305: 38.73,12.7 IC7.6 | R4.2 38.73,12.7 | 38.73,12.7 R3.2
N$11
  Top 0.305: C6.1 92.71,46.99 | 95.25,46.99 X2.1
  Top 2.184: 92.71,46.99 95.25,46.99
N$12
  Top 0.305: C5.1 92.71,15.24
  Top 2.184: 92.71,15.24 X1.1
N$13
  Top 0.61: VCO1.14 60.07,25.4 | 60.07,25.4 60.07,26.99 C19.1 | 60.07,25.4 C20.1 | 60.07,25.4 FB2.2
N$14
  Top 0.61: VCO2.14 60.07,56.83 | C22.1 60.07,58.42 60.07,57.78 | 60.07,56.83 C21.1 | 60.07,56.83 60.07,57.78 | 60.07,57.78 FB3.2
N$17  (1 unrouted)
N$18  (1 unrouted)
N$19  (1 unrouted)
N$20  (2 unrouted)
N$21  (1 unrouted)
N$22
  Top 0.61: C31.1 R23.1 | C31.1 C32.1 | C31.1 C30.1 90.56,20.71 88.9,19.05 L4.1
N$23
  Top 0.406: R45.1 18.63,7.88 T2.2
N$24
  Top 0.305: R32.2 67.31,19.05 | 67.31,19.05 R31.2 | 67.31,19.05 R30.1
N$26
  Top 0.305: 88.9,46.99 L3.2 | 90.17,46.99 C6.2 | IC5.3 87,47.23 87,46.99
  Top 2.184: 87,46.99 88.9,46.99 90.17,46.99
N$28
  Top 0.305: 88.9,15.24 L4.2 | 90.17,15.24 C5.2 | IC6.3 87,15.48 87,15.24
  Top 2.184: 87,15.24 88.9,15.24 90.17,15.24
N$30  (1 unrouted)
N$31
  Top 0.305: 73.98,15.24 R24.1 | R25.2 72.71,15.24 | 71.12,15.24 R26.2
  Top 2.184: 71.12,15.24 72.71,15.24 73.98,15.24
N$32
  Top 0.254: 80.33,15.24 C23.1 | C24.2 81.6,15.24 | 83.19,15.24 83.59,15.24 IC6.1
  Top 2.184: 80.01,15.24 80.33,15.24 81.6,15.24 83.19,15.24
N$33
  Top 0.305: 77.47,15.24 C23.2 | R24.2 76.52,15.24
  Top 2.184: 76.52,15.24 77.47,15.24
N$34
  Top 0.406: R44.1 R43.2 20.74,6.08 T2.1
N$35
  Top 0.305: 73.66,46.99 R27.1 | R29.2 71.12,46.99 | 72.39,46.99 R28.2
  Top 2.184: 71.12,46.99 72.39,46.99 73.66,46.99 73.98,46.99
N$36
  Top 0.305: 83.19,46.99 83.59,46.99 IC5.1 | C25.2 81.28,46.59 81.28,46.99 | C26.1 80.01,46.99
  Top 2.184: 80.01,46.99 81.28,46.99 83.19,46.99
N$37
  Top 0.305: R27.2 76.52,46.99 | 77.47,46.99 C26.2
  Top 2.184: 76.52,46.99 77.47,46.99
N$38
  Top 0.61: R17.1 C28.1 | C28.1 C27.1 90.56,41.52 88.9,43.18 L3.1 | C28.1 C29.1
N$39
  Top 0.305: R30.2 71.12,19.05 | 71.12,19.05 C33.1 | 71.12,19.05 R33.2
N$40  (1 unrouted)
N$44  (2 unrouted)
N$45  (2 unrouted)
OSC1  (1 unrouted)
  Top 0.305: C3.1 66.09,35.95 Q2.P$1
OSC2  (1 unrouted)
  Top 0.305: Q2.P$3 70.1,37.77 C4.1
OUT_VCO_A
  Top 0.254: 67.31,15.24 R32.1 | 68.58,15.24 R26.1
  Top 2.184: 64.45,15.24 VCO1.10 67.31,15.24 68.58,15.24
OUT_VCO_B
  Top 0.305: 68.58,46.99 R29.1 | 67.31,46.99 R36.1
  Top 2.184: 64.45,46.99 VCO2.10 67.31,46.99 68.58,46.99
PRETERM
  Top 0.254: R15.2 12.38,38.1 11.43,37.15 11.43,35.24 11.11,34.92 9.84,34.92 9.4,35.37 U3.4
RF_A  (1 unrouted)
RF_B  (1 unrouted)
RST  (2 unrouted)
SAWTOOTH  (1 unrouted)
  Top 0.406: IC2.6 IC2.7 IC2.2 26.04,3.17 25.4,2.54 20.95,2.54 20.71,2.78 C38.1 20.71,3.98 T2.3
SAWTOOTH_BUFF  (3 unrouted)
SCK  (via drill 0.33)  (3 unrouted)
  Top 0.305: IC3.19 78.23,26.54 v78.74,26.04
  Bottom 0.305: v78.74,26.04 78.74,4.76 77.15,3.17 64.77,3.17
SW_5V
  pour Top (no thermals): 25.4,50.8 25.4,53.98 34.92,53.98 34.92,51.44 35.56,50.8 35.56,48.26 27.94,48.26
SW_24V
  pour Top (no thermals): 35.56,45.72 38.73,45.72 38.73,36.2 36.2,36.2 35.56,35.56 33.02,35.56 33.02,43.18
TS
  Top 0.254: U3.9 8.38,43.94 8.89,44.45 11.75,44.45 12.06,44.13 12.06,43.5 12.38,43.18 R16.2
U_D+  (1 unrouted)
U_D-  (1 unrouted)
USB_DET  (1 unrouted)
VCC
  Top 0.813: S1.2 13.21,46.23 16.24,49.26 16.24,49.53 | 16.24,49.53 B1.2 | C18.+ 22.86,50.8 21.59,49.53 16.24,49.53
  pour Top (no thermals): 4.76,46.67 7.94,46.67 7.94,41.91 6.99,41.91 6.67,42.23 6.67,45.09 6.67,45.4 6.35,45.72 4.76,45.72
VCC_SW  (via drill 0.33)
  Top 0.813: S1.1 7.32,49.23 7.62,49.53 v7.62,52.39 v7.62,53.34
  Bottom 0.813: v7.62,52.39 v7.62,53.34 7.62,54.61 10.16,57.15 v34.61,57.15 36.83,57.15 41.91,52.07 v41.91,36.51 v41.91,35.56
  other vias: 35.56,57.15
  pour Top (no thermals): 25.4,55.24 36.83,55.24 36.83,56.52 34.61,58.74 25.4,58.74
  pour Top (no thermals): 40.01,45.72 40.01,34.29 41.27,34.29 43.5,36.51 43.5,45.72
VTUNE_A  (1 unrouted)
  Top 0.254: 50.42,16.89 VCO1.2
  Top 0.305: IC7.7 40.01,14.19 R3.1
VTUNE_B  (1 unrouted)
  Top 0.254: VCO2.2 49.91,48.64 49.53,48.26 49.53,25.4
  Top 0.305: IC7.1 41.27,22.86 R2.1
XTAL1  (2 unrouted)
XTAL2  (2 unrouted)